# Altium schematic sheet [04] - DOC REVISION HISTORY.SchDoc
size A3; DocumentNumber: 3; SheetNumber: 3; SheetTotal: 4
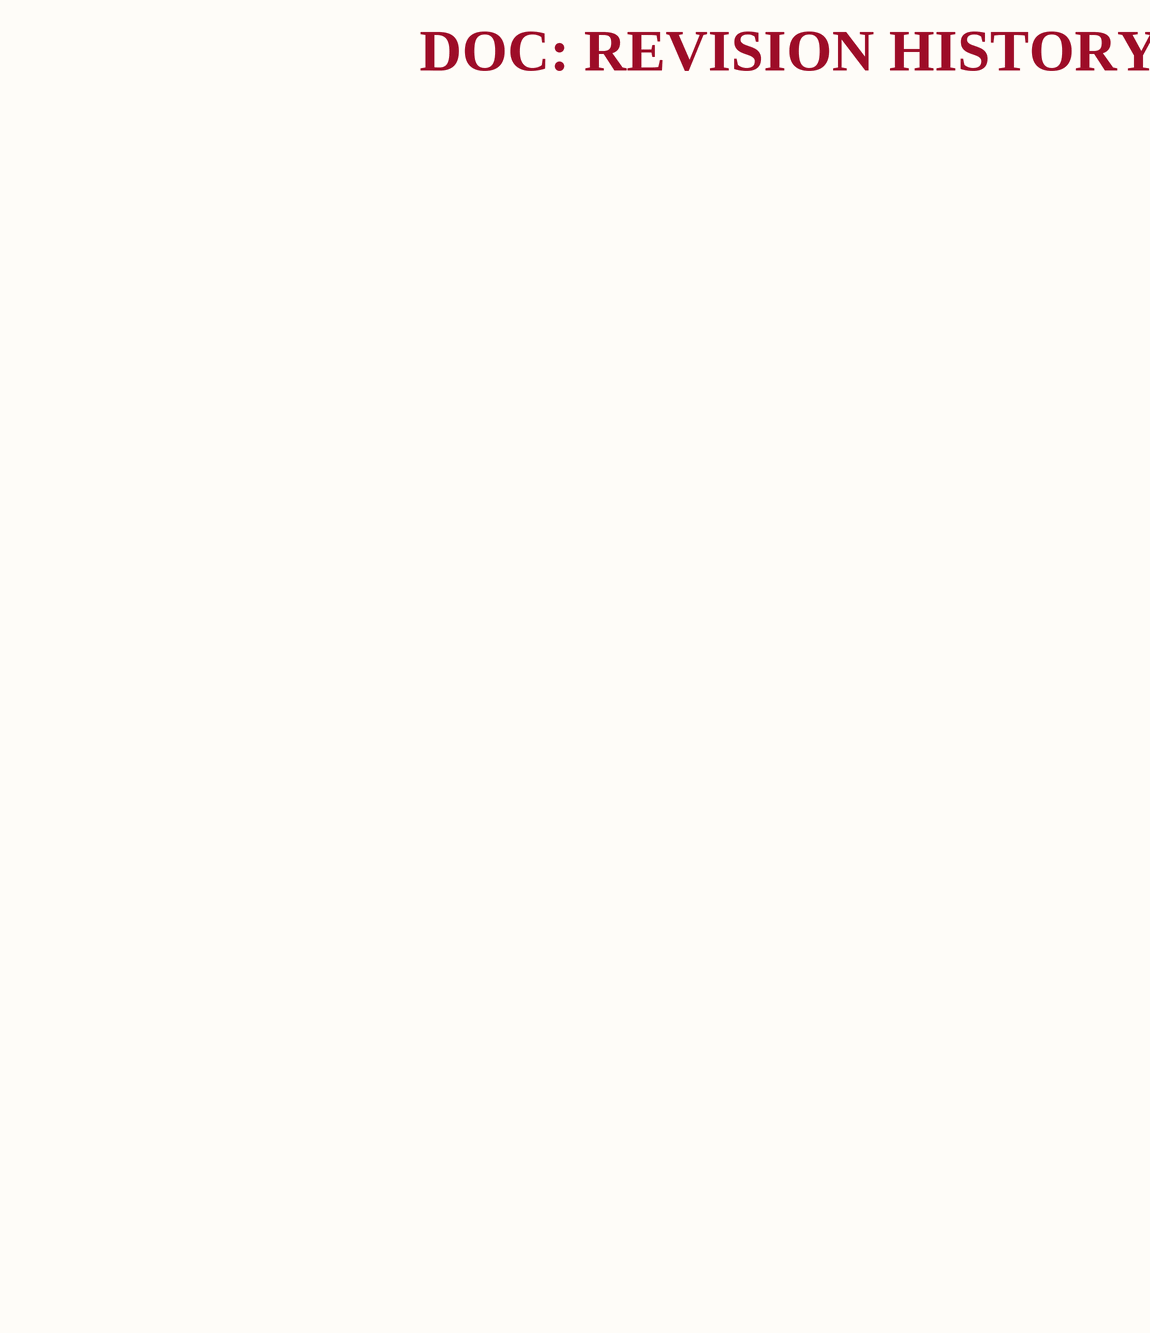
[diagram p0: [04] - DOC REVISION HISTORY.SchDoc]

## Notes on the sheet
- DOC: REVISION HISTORY
- CLOCKS (CPU & PCIE)
- Designed By
- Checked By
- Company:
- Size:
- A3
- Address:
- Sheet:
- /